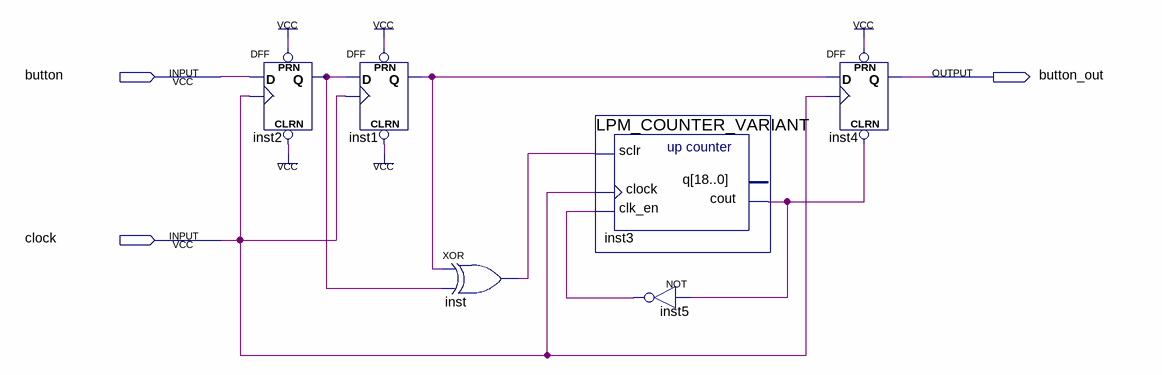
[diagram p0: schematic sheet]
// Quartus schematic debouncer.bdf as structural Verilog: 6 symbols, 3 pins
module debouncer (
  input  button,
  input  clock,
  output button_out
);

  wire inst1_q, inst2_q, inst3_cout, inst5_out, inst_out;

  DFF inst2 (.CLRN(1'b1), .CLK(clock), .D(button), .PRN(1'b1), .Q(inst2_q));
  DFF inst1 (.CLRN(1'b1), .CLK(clock), .D(inst2_q), .PRN(1'b1), .Q(inst1_q));
  xor inst (inst_out, inst1_q, inst2_q);
  LPM_COUNTER_VARIANT inst3 (.sclr(inst_out), .clock(clock), .clk_en(inst5_out), .cout(inst3_cout));  // open: q
  not inst5 (inst5_out, inst3_cout);
  DFF inst4 (.CLRN(inst3_cout), .CLK(clock), .D(inst1_q), .PRN(1'b1), .Q(button_out));
endmodule
